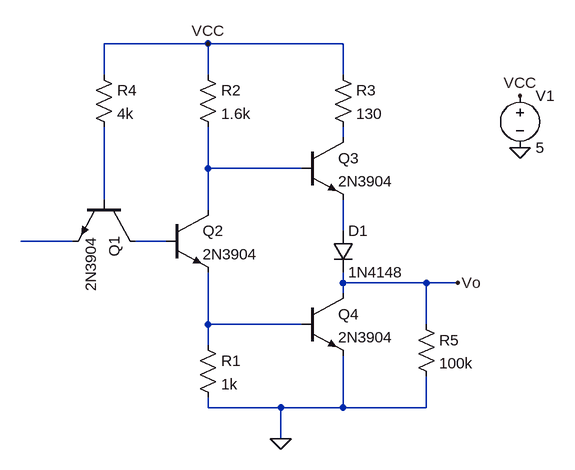
[diagram p0: schematic Draft1.asc]
Draft1.asc, the LTspice schematic file:
Version 4
SHEET 1 880 680
WIRE 80 -64 -80 -64
WIRE 288 -64 80 -64
WIRE -80 -16 -80 -64
WIRE 80 -16 80 -64
WIRE 288 -16 288 -64
WIRE 288 80 288 64
WIRE 80 128 80 64
WIRE 224 128 80 128
WIRE -80 176 -80 64
WIRE 80 192 80 128
WIRE 288 224 288 176
WIRE -128 240 -208 240
WIRE 16 240 -32 240
WIRE 288 304 288 288
WIRE 416 304 288 304
WIRE 464 304 416 304
WIRE 288 320 288 304
WIRE 80 368 80 288
WIRE 224 368 80 368
WIRE 416 368 416 304
WIRE 80 400 80 368
WIRE 80 496 80 480
WIRE 192 496 80 496
WIRE 288 496 288 416
WIRE 288 496 192 496
WIRE 416 496 416 448
WIRE 416 496 288 496
WIRE 192 544 192 496
FLAG 192 544 0
FLAG 464 304 Vo
FLAG 80 -64 VCC
FLAG 560 96 0
FLAG 560 16 VCC
SYMBOL npn -32 176 R90
SYMATTR InstName Q1
SYMATTR Value 2N3904
SYMBOL npn 16 192 R0
SYMATTR InstName Q2
SYMATTR Value 2N3904
SYMBOL npn 224 80 R0
SYMATTR InstName Q3
SYMATTR Value 2N3904
SYMBOL npn 224 320 R0
SYMATTR InstName Q4
SYMATTR Value 2N3904
SYMBOL diode 272 224 R0
SYMATTR InstName D1
SYMATTR Value 1N4148
SYMBOL res 64 384 R0
SYMATTR InstName R1
SYMATTR Value 1k
SYMBOL res 64 -32 R0
SYMATTR InstName R2
SYMATTR Value 1.6k
SYMBOL res 272 -32 R0
SYMATTR InstName R3
SYMATTR Value 130
SYMBOL res -96 -32 R0
SYMATTR InstName R4
SYMATTR Value 4k
SYMBOL res 400 352 R0
SYMATTR InstName R5
SYMATTR Value 100k
SYMBOL voltage 560 0 R0
WINDOW 123 0 0 Left 0
WINDOW 39 0 0 Left 0
SYMATTR InstName V1
SYMATTR Value 5

The netlist it stands for:
* Draft1.asc
Q1 N006 N003 N005 0 2N3904
Q2 N002 N006 N007 0 2N3904
Q3 N001 N002 N004 0 2N3904
Q4 Vo N007 0 0 2N3904
D1 N004 Vo 1N4148
R1 N007 0 1k
R2 VCC N002 1.6k
R3 VCC N001 130
R4 VCC N003 4k
R5 Vo 0 100k
V1 VCC 0 5
.model D D
.lib standard.dio
.model NPN NPN
.model PNP PNP
.lib standard.bjt
.backanno
.end